# EAGLE design microvboatBOARD (EAGLE 7.6.0)
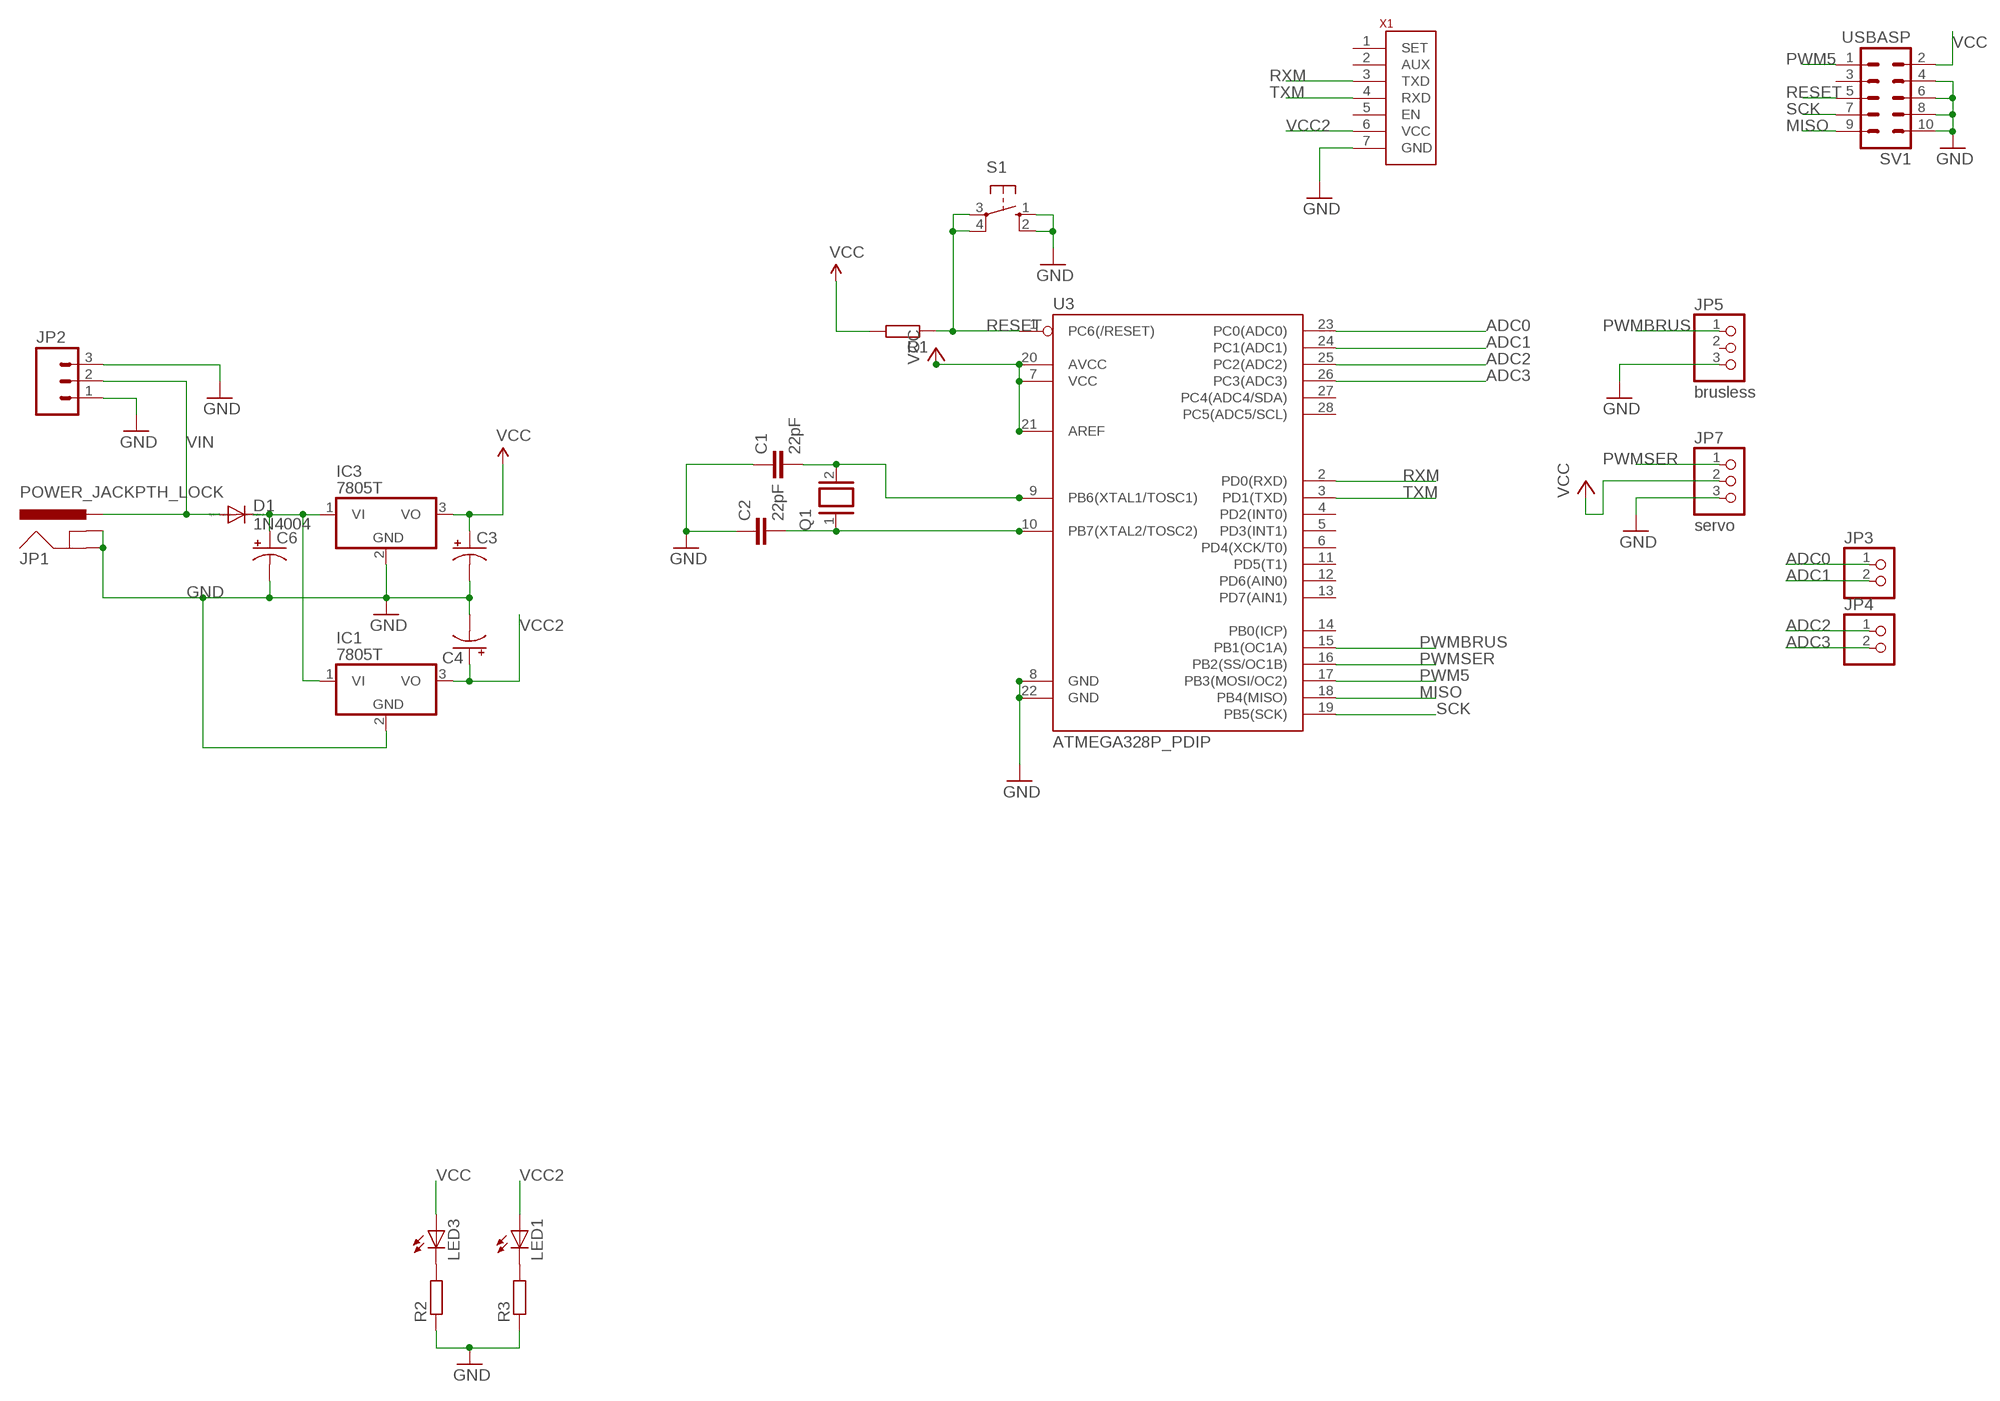
[diagram p0: schematic, sheet 1]

## Parts
C1  22pF  C2,5-3  [C2.5-3]
C2  22pF  C2,5-3  [C2.5-3]
C3  CPOL-USE2.5-5  [E2,5-5]
C4  CPOL-USE2.5-5  [E2,5-5]
C6  CPOL-USE2.5-5  [E2,5-5]
D1  1N4004  [DO41-10]
IC1  7805T  [TO220H]
IC3  7805T  [TO220H]
JP1  POWER_JACKPTH_LOCK  [POWER_JACK_PTH_LOCK]
JP2  M03POLAR  [MOLEX-1X3]
JP3  PINHD-1X2  [1X02]
JP4  PINHD-1X2  [1X02]
JP5  brusless  PINHD-1X3  [1X03]
JP7  servo  PINHD-1X3  [1X03]
LED1  LED3MM  [LED3MM]
LED3  LED3MM  [LED3MM]
Q1  XTAL/S  [QS]
R1  R-EU_0204/7  [0204/7]
R2  R-EU_0204/7  [0204/7]
R3  R-EU_0204/7  [0204/7]
S1  10-XX  [B3F-10XX]
SV1  USBASP  ML10  [ML10]
U3  ATMEGA328P_PDIP  [DIL28-3]
X1  APC220  [APC220]

## Nets
ADC0: JP3.1 U3.23(PC0(ADC0))
ADC1: JP3.2 U3.24(PC1(ADC1))
ADC2: JP4.1 U3.25(PC2(ADC2))
ADC3: JP4.2 U3.26(PC3(ADC3))
GND: C1.1 C2.1 C3.- C4.- C6.- IC1.2(GND) IC3.2(GND) JP1.GND JP1.GNDBREAK JP2.1 JP2.3 JP5.3 JP7.3 R2.1 R3.1 S1.1(S) S1.2(S1) SV1.4 SV1.6 SV1.8 SV1.10 U3.8(GND) U3.22(GND) X1.7(GND)
MISO: SV1.9 U3.18(PB4(MISO))
N$1: LED3.K(C) R2.2
N$2: C1.2 Q1.2 U3.9(PB6(XTAL1/TOSC1))
N$3: C2.2 Q1.1 U3.10(PB7(XTAL2/TOSC2))
N$4: LED1.K(C) R3.2
N$6: C6.+ D1.C IC1.1(VI) IC3.1(VI)
PWM5: SV1.1 U3.17(PB3(MOSI/OC2))
PWMBRUS: JP5.1 U3.15(PB1(OC1A))
PWMSER: JP7.1 U3.16(PB2(SS/OC1B))
RESET: R1.1 S1.3(P) S1.4(P1) SV1.5 U3.1(PC6(/RESET))
RXM: U3.2(PD0(RXD)) X1.3(TXD)
SCK: SV1.7 U3.19(PB5(SCK))
TXM: U3.3(PD1(TXD)) X1.4(RXD)
VCC: C3.+ IC3.3(VO) JP7.2 LED3.A R1.2 SV1.2 U3.7(VCC) U3.20(AVCC) U3.21(AREF)
VCC2: C4.+ IC1.3(VO) LED1.A X1.6(VCC)
VIN: D1.A JP1.PWR JP2.2
Unconnected: JP5.2 SV1.3 U3.4(PD2(INT0)) U3.5(PD3(INT1)) U3.6(PD4(XCK/T0)) U3.11(PD5(T1)) U3.12(PD6(AIN0)) U3.13(PD7(AIN1)) U3.14(PB0(ICP)) U3.27(PC4(ADC4/SDA)) U3.28(PC5(ADC5/SCL)) X1.1(SET) X1.2(AUX) X1.5(EN)

## Library data of the parts
C1 C2 = capacitor-wima:C: CAPACITOR naming: grid - package width
C3 C4 C6 = rcl:CPOL-US: POLARIZED CAPACITOR, American symbol
D1 = diode:1N4004: DIODE general purpose rectifier, 1 A
IC1 IC3 = linear:78*: Positive VOLTAGE REGULATOR Source: http://cache.national.com/ds/LM/LM78L05.pdf http://www.fairchildsemi.com/ds/LM/LM7805.pdf
JP1 = SparkFun-Connectors:POWER_JACK: Power Jack This is the standard 5.5mm barrel jack for power. The PTH is the most common, proven, reliable, footprint. The Slot footprint only works if the mill layer is transmitted to the PCB fab house so be warned. Mating wall wart : TOL-00298 (and others); PROD_ID: CONN-08197; SF_ID: PRT-00119
JP2 = SparkFun-Connectors:M03: Header 3 Standard 3-pin 0.1" header. Use with straight break away headers (SKU : PRT-00116), right angle break away headers (PRT-00553), swiss pins (PRT-00743), machine pins (PRT-00117), and female headers (PRT-00115). Molex polarized connector foot print use with SKU : PRT-08232 with associated crimp pins and housings.
JP3 JP4 = pinhead:PINHD-1X2: PIN HEADER
JP5 JP7 = pinhead:PINHD-1X3: PIN HEADER
LED1 LED3 = led:LED: LED OSRAM: - CHIPLED LG R971, LG N971, LY N971, LG Q971, LY Q971, LO R971, LY R971 LH N974, LH R974 LS Q976, LO Q976, LY Q976 LO Q996 - Hyper CHIPLED LW Q18S LB Q993, LB Q99A, LB R99A - SideLED LS A670, LO A670, LY A670, LG A670, LP A670 LB A673, LV A673, LT A673, LW A673 LH A674 LY A675 LS A676, LA A676, LO A676, LY A676, LW A676 LS A679, LY A679, LG A679 - Hyper Micro SIDELED® LS Y876, LA Y876, LO Y876, LY Y876 LT Y87S - SmartLED LW L88C, LW L88S LB L89C, LB L89S, LG L890 LS L89K, LO L89K, LY L89K LS L896, LA L896, LO L896, LY L896 - TOPLED LS T670, LO T670, LY T670, LG T670, LP T670 LSG T670, LSP T670, LSY T670, LOP T670, LYG T670 LG T671, LOG T671, LSG T671 LB T673, LV T673, LT T673, LW T673 LH T674 LS T676, LA T676, LO T676, LY T676, LB T676, LH T676, LSB T676, LW T676 LB T67C, LV T67C, LT T67C, LS T67K, LO T67K, LY T67K, LW E67C LS E67B, LA E67B, LO E67B, LY E67B, LB E67C, LV E67C, LT E67C LW T67C LS T679, LY T679, LG T679 LS T770, LO T770, LY T770, LG T770, LP T770 LB T773, LV T773, LT T773, LW T773 LH T774 LS E675, LA E675, LY E675, LS T675 LS T776, LA T776, LO T776, LY T776, LB T776 LHGB T686 LT T68C, LB T68C - Hyper Mini TOPLED® LB M676 - Mini TOPLED Santana® LG M470 LS M47K, LO M47K, LY M47K Source: http://www.osram.convergy.de LUXEON: - LUMILED® LXK2-PW12-R00, LXK2-PW12-S00, LXK2-PW14-U00, LXK2-PW14-V00 LXK2-PM12-R00, LXK2-PM12-S00, LXK2-PM14-U00 LXK2-PE12-Q00, LXK2-PE12-R00, LXK2-PE12-S00, LXK2-PE14-T00, LXK2-PE14-U00 LXK2-PB12-K00, LXK2-PB12-L00, LXK2-PB12-M00, LXK2-PB14-N00, LXK2-PB14-P00, LXK2-PB14-Q00 LXK2-PR12-L00, LXK2-PR12-M00, LXK2-PR14-Q00, LXK2-PR14-R00 LXK2-PD12-Q00, LXK2-PD12-R00, LXK2-PD12-S00 LXK2-PH12-R00, LXK2-PH12-S00 LXK2-PL12-P00, LXK2-PL12-Q00, LXK2-PL12-R00 Source: www.luxeon.com KINGBRIGHT: KA-3528ASYC Source: www.kingbright.com
Q1 = special:XTAL/S: CRYSTAL
R1-R3 = rcl:R-EU_: RESISTOR, European symbol
S1 = switch-omron:10-XX: OMRON SWITCH; MPN: B3F-1000; OC_FARNELL: 176432; OC_NEWARK: 36M3542
SV1 = con-ml:ML10: HARTING; OC_FARNELL: unknown; OC_NEWARK: unknown
U3 = SparkFun-DigitalIC:ATMEGA328P_PDIP: uC used in the Arduino 32kb flash, 1k EEPROM, 2k SRAM This is the through-hole version of this chip.
X1 = APC220:APC220; APC220: APC220

## Board
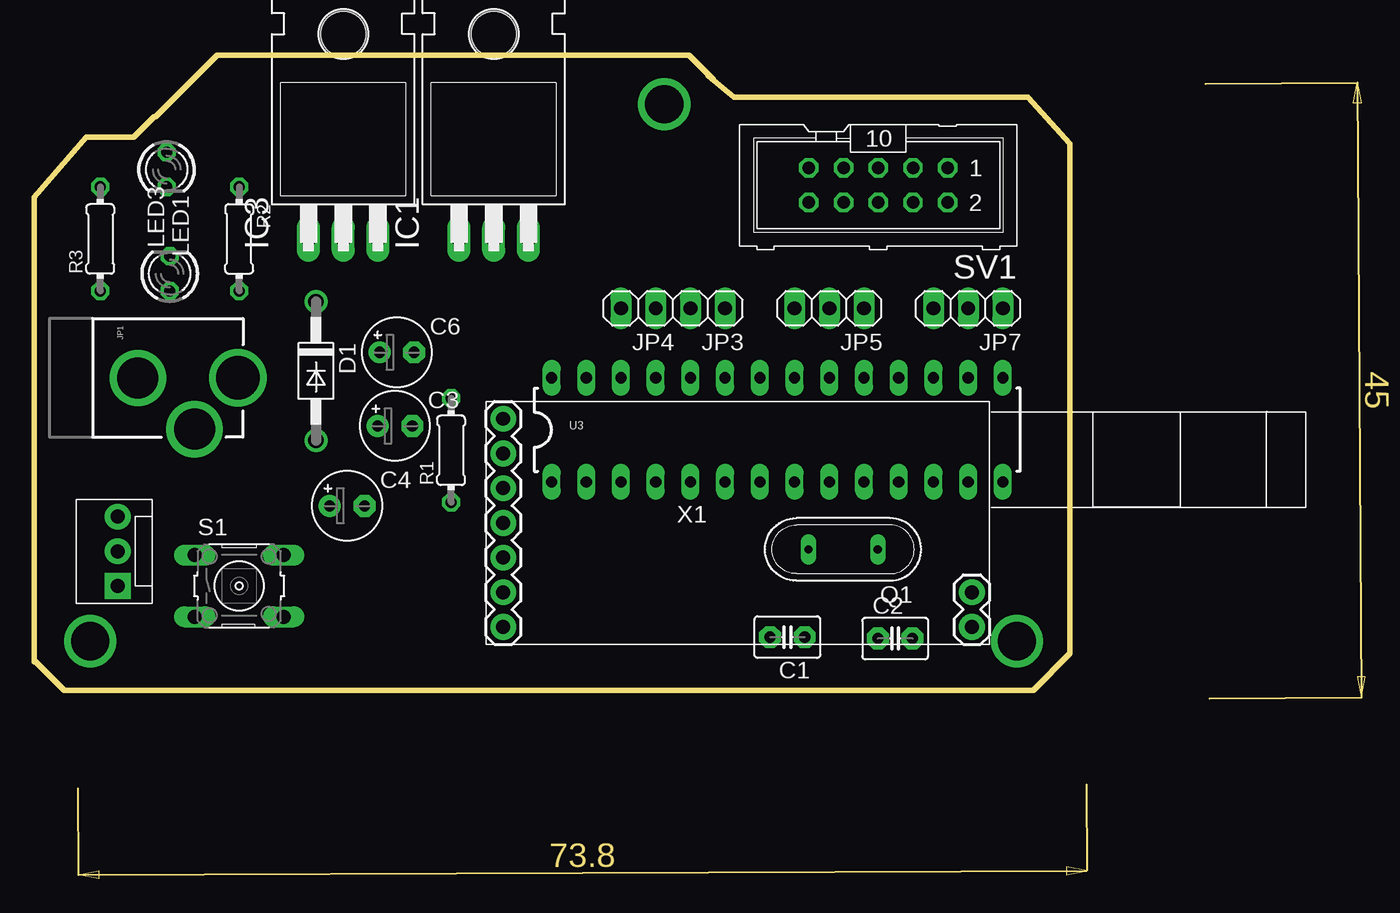
[diagram p1: board, top side]
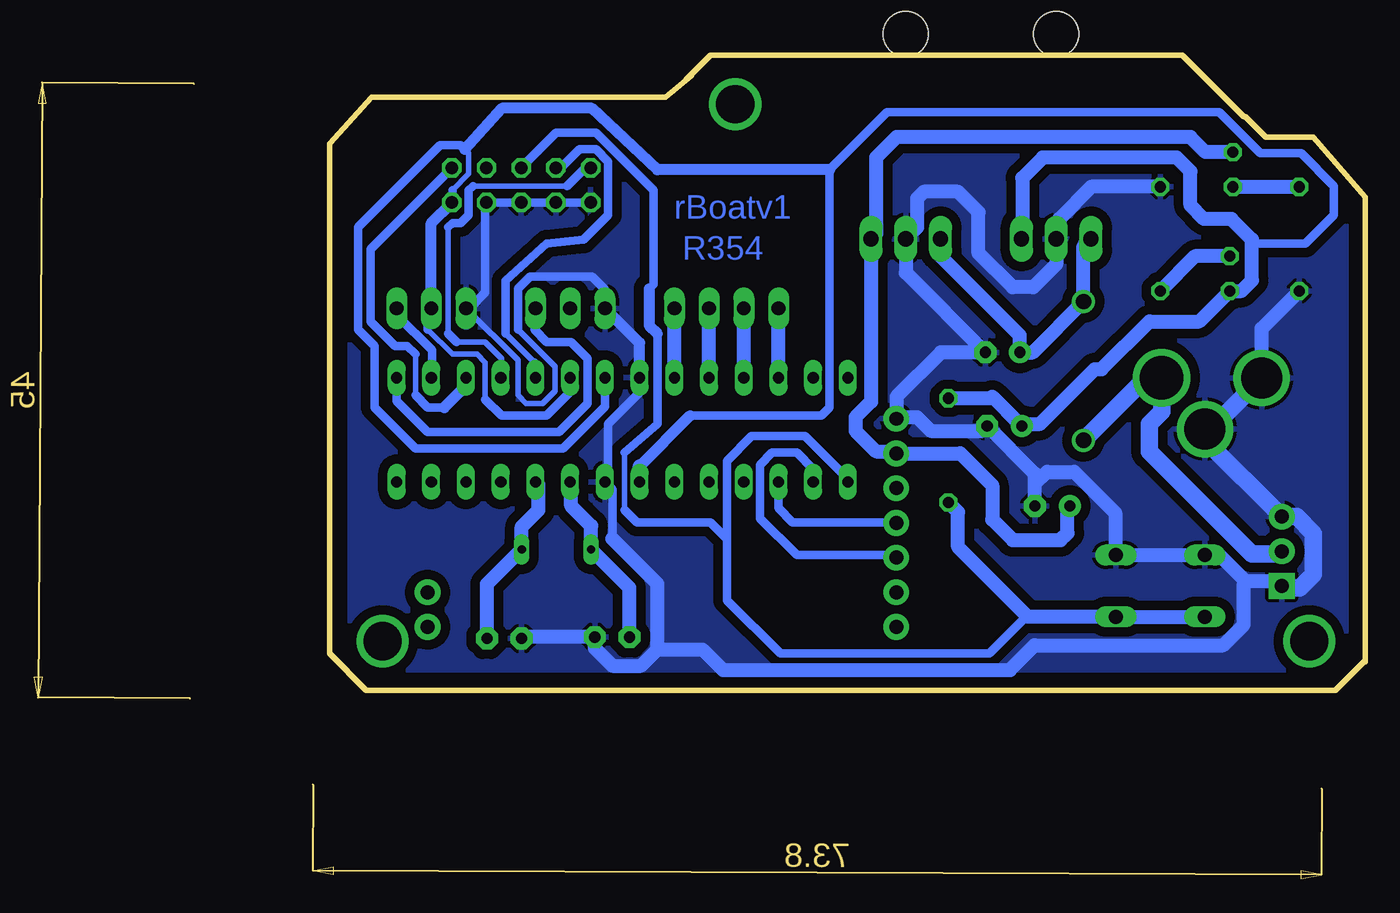
[diagram p2: board, bottom side, seen from below]

Size 75.8 x 46.5 mm. Coordinates in mm from the lower left corner, seen from the top.
Outline: 49.3,45 51.2,43.4 72.7,43.4 75.8,40 75.8,4
Outline: 73,0 2.2,0 0,2.2
Outline: 0,2.1 0,2.2
Outline: 0,2.2 0,36.1 3.8,40.5 7.3,40.5 8.8,42
Outline: 8.9,42 13.4,46.5 47.9,46.5 49.7,44.7
Outline: 75.8,3.9 75.8,2.7 73.1,0
Copper layers (1*16): Top 0.035mm / dielectric 1.5mm / Bottom 0.035mm
Design rules "default": minimum track width 10mil, minimum drill 24mil, track to track 8mil, track to pad 8mil, pad to pad 8mil, via to via 8mil, smd to smd 8mil, copper to edge 40mil, drill to drill 8mil, minimum pad ring 10mil, minimum via ring 8mil, stop-mask expansion 4mil, vias tented up to drill 0mil, thermal gap 10mil

### Footprints (pad centres in the part's own frame; a part is rotated, then mirrored left to right if it is on the bottom)
C2.5-3 = drill 0.813 pad 1.6 octagon: 1 -1.27,0; 2 1.27,0
E2,5-5 = drill 0.813 pad 1.6: + -1.27,0 | drill 0.813 pad 1.6 octagon: - 1.27,0
DO41-10 = drill 1.118: A 5.08,0; C -5.08,0
TO220H = drill 1.118 long: 1 -2.54,-10.16; 2 0,-10.16; 3 2.54,-10.16 | hole 3.302: 0,4.826
POWER_JACK_PTH_LOCK = drill 2.997 pad 4.115: GND 0.025,6.557; GNDBREAK 3.762,10.7 | drill 3.2 pad 4.115: PWR 0,13.878
MOLEX-1X3 = drill 1.016 pad 1.88 square: 1 0,0 | drill 1.016 pad 1.88: 2 2.54,0; 3 5.08,0
1X02 = drill 1.016 long: 1 -1.27,0; 2 1.27,0
1X03 = drill 1.016 long: 1 -2.54,0; 2 0,0; 3 2.54,0
LED3MM = drill 0.813 octagon: A -1.27,0; K 1.27,0
QS = drill 0.61 long: 1 -2.54,0; 2 2.54,0
0204/7 = drill 0.813 octagon: 1 -3.81,0; 2 3.81,0
B3F-10XX = drill 1.016 long: 1 -3.251,2.261; 2 3.251,2.261; 3 -3.251,-2.261; 4 3.251,-2.261
ML10 = drill 0.914 octagon: 1 -5.08,-1.27; 2 -5.08,1.27; 3 -2.54,-1.27; 4 -2.54,1.27; 5 0,-1.27; 6 0,1.27; 7 2.54,-1.27; 8 2.54,1.27; 9 5.08,-1.27; 10 5.08,1.27
DIL28-3 = drill 0.813 long: 1 -16.51,-3.81; 2 -13.97,-3.81; 3 -11.43,-3.81; 4 -8.89,-3.81; 5 -6.35,-3.81; 6 -3.81,-3.81; 7 -1.27,-3.81; 8 1.27,-3.81; 9 3.81,-3.81; 10 6.35,-3.81; 11 8.89,-3.81; 12 11.43,-3.81; 13 13.97,-3.81; 14 16.51,-3.81; 15 16.51,3.81; 16 13.97,3.81; 17 11.43,3.81; 18 8.89,3.81; 19 6.35,3.81; 20 3.81,3.81; 21 1.27,3.81; 22 -1.27,3.81; 23 -3.81,3.81; 24 -6.35,3.81; 25 -8.89,3.81; 26 -11.43,3.81; 27 -13.97,3.81; 28 -16.51,3.81
APC220 = drill 1.016 pad 1.88: 00 35.56,1.27; 1 1.27,1.27; 01 35.56,3.81; 2 1.27,3.81; 3 1.27,6.35; 4 1.27,8.89; 5 1.27,11.43; 6 1.27,13.97; 7 1.27,16.51

### Placement (x,y rotation side)
C1  55.11,3.9 180 top
C2  63,3.8 0 top
C3  26.4,19.35 0 top
C4  22.9,13.51 0 top
C6  26.54,24.74 0 top
D1  20.62,23.38 270 top
IC1  33.63,43.2 0 top
IC3  22.62,43.2 0 top
JP1  1.03,22.88 270 top
JP2  6.11,7.64 90 top
JP3  49.29,27.96 180 top
JP4  44.21,27.96 180 top
JP5  58.18,27.96 180 top
JP7  68.34,27.96 180 top
LED1  9.69,38.12 270 top
LED3  9.92,30.5 90 top
Q1  59.19,10.32 180 top
R1  30.51,17.57 90 top
R2  15,33.04 270 top
R3  4.84,33.04 90 top
S1  15,7.64 0 top
SV1  61.76,36.97 180 top
U3  54.37,19.07 0 top
X1  33.05,3.37 0 top

### Tracks (layer width: path | path; a pad name or v marks a point on that pad's centre or on a via)
ADC0
  Bottom 1.016: U3.23 JP3.1
ADC1
  Bottom 1.016: U3.24 JP3.2
ADC2
  Bottom 1.016: U3.25 JP4.1
ADC3
  Bottom 1.016: U3.26 JP4.2
GND
  Bottom 0.406: 55.1,11.1 55.1,10.8 52.1,7.8 52.1,3.6 51.5,3 | 62,26.4 59.3,23.7 59.3,21.9 60.2,21 61.4,21 62,21.6 62,24.16 JP7.3
  Bottom 0.61: JP7.3 65.54,27.96 64.4,29.1 64.4,35.6 SV1.4 SV1.6 SV1.8 SV1.10 | U3.22 53.1,21.8 55.4,19.5 55.4,15.5 U3.8 55.1,14.72 55.1,11.1 | JP5.3 55.64,29.34 56.6,30.3 61.1,30.3 62,29.4 62,26.4
  Bottom 0.813: U3.22 53.1,25.42 JP5.3
  Bottom 1.016: JP1.GND 7.59,26.48 R3.1 | R2.1 20.05,36.85 22.4,34.5 22.4,33.26 IC3.2 22.62,31.18 24.3,29.5 25.8,29.5 28.3,32 28.3,35 29.8,36.5 32.3,36.5 32.8,36 32.8,33.87 IC1.2 33.63,30.56 C6.- 31.06,24.74 34.3,21.5 34.3,20 | 34.3,20 34.3,19.9 X1.7 | 34.3,20 32.8,20 31.8,19 28.02,19 C3.- 24.17,15.85 C4.- 24.17,15.13 23.3,16 21.3,16 18.3,13 18.3,9.95 S1.2 S1.1 10.7,9.9 8.8,8 8.6,8 | 8.6,8 6.47,8 JP2.1 | C2.1 61.63,3.9 C1.1 56.38,3.08 55.1,1.8 53,1.8 51.8,3 51.8,7.8 55.1,11.1 | 51.5,3 48.5,3 47,1.5 26,1.5 24.2,3.3 10.4,3.3 8.9,4.8 8.9,7.7 8.6,8
  Bottom 1.27: JP1.GND 11.32,19.12 JP1.GNDBREAK 11.73,18.34 JP2.3 5.02,12.72 3.8,11.5 3.8,8.5 4.8,7.5 5.97,7.5 JP2.1
  pour Bottom (isolate 0.7): 1.1,35.4 1.1,3 2.6,1.5 71.9,1.5 74.3,3.9 74.3,39.3 74,39.6 71.6,42 50.3,42 47,45.3 13.7,45.3 11,42.6 7.4,39 4.7,39
MISO
  Bottom 0.406: 67.1,33.9 67.1,26.1 | 66.5,25.5 64.4,25.5 63.2,24.3 63.2,22.94 | 58.4,36.9 65.3,36.9
  Bottom 0.61: 67.1,26.1 66.5,25.5 | 63.2,22.94 U3.18 | 67.1,33.9 66.8,34.2 66.2,34.2 65.6,34.8 65.6,36.6 65.3,36.9 | SV1.9 57.06,38.24 58.4,36.9
N$1
  Bottom 1.016: LED3.K 12.46,31.77 R2.2
N$2
  Bottom 1.016: U3.9 58.1,15.18 58.1,13.5 56.65,12.05 Q1.2 53.84,7.51 C1.2
N$3
  Bottom 1.016: U3.10 60.5,15.04 60.5,13.2 61.73,11.97 Q1.1 64.27,7.78 C2.2
N$4
  Bottom 1.016: LED1.K R3.2
N$5  (via drill 2.8 pad 1.27)
  other vias: 46.1,42.9
N$6
  Bottom 1.016: IC3.1 20.62,32.5 D1.C 24.34,24.74 C6.+ 25.3,24.77 25.3,26 31.09,31.79 IC1.1
N$7  (via drill 2.8 pad 1.27)
  other vias: 71.9,3.6
N$8  (via drill 2.8 pad 1.27)
  other vias: 4.1,3.6
PWM5
  Bottom 0.406: 69.5,21.6 69.5,24.6
  Bottom 0.61: 69.5,21.6 68.6,20.7 67.4,20.7 | SV1.1 72.8,32.28 72.8,27 71,25.2 70.1,25.2 69.5,24.6
  Bottom 0.813: U3.17 65.8,22.3 67.4,20.7
PWMBRUS
  Bottom 0.61: U3.15 70.88,21.18 68.6,18.9 59,18.9 56.9,21 56.9,24.3 58.1,25.5 59.9,25.5 60.8,26.4 60.8,27.88 JP5.1
PWMSER
  Bottom 0.61: JP7.1 70.88,27.48 68.3,24.9 68.3,22.92 U3.16
RESET
  Bottom 0.406: 54.2,17.4 54.2,13.2
  Bottom 0.61: U3.1 37.86,15.46 41,18.6 44.9,18.6 46.7,16.8 46.7,11.1 | 46.7,11.1 46.7,6.6 42.8,2.7 27.5,2.7 24.75,5.45 | 51.8,26.1 51.8,19.5 54.2,17.4 | 54.2,13.2 53.3,12.3 47.9,12.3 46.7,11.1 | 52.4,29.4 52.1,29.7 52.1,36.6 56.3,40.8 59.2,40.8 SV1.5
  Bottom 0.813: 52.4,29.4 52.4,26.7 51.8,26.1
  Bottom 1.016: R1.1 29.8,13.05 29.8,10.5 24.75,5.45 24.68,5.38 S1.4 S1.3
RXM
  Bottom 0.61: U3.2 40.4,16.2 41.6,17.4 43.4,17.4 44.3,16.5 44.3,12.6 41.6,9.9 34.5,9.9 X1.3
SCK
  Bottom 0.406: 60.8,24 62.9,26.1
  Bottom 0.61: SV1.7 58.86,38.24 57.5,39.6 56.3,39.6 55.4,38.7 55.4,34.8 57.2,33 59.9,32.7 62.9,30 62.9,26.1 | U3.19 60.8,22.96 60.8,24
TXM
  Bottom 0.61: U3.3 42.94,13.34 41.9,12.3 34.36,12.3 X1.4
VCC
  Bottom 0.406: 64.4,21.3 64.4,24 65,24.6 66.8,24.6 68.6,26.4 | 65.9,39.6 65.6,39.3 65.6,37.8 66.8,36.6
  Bottom 0.61: U3.20 58.18,21.82 59.9,20.1 63.2,20.1 64.4,21.3 | 68.6,26.4 68.6,27.7 JP7.2 | U3.21 55.64,20.76 58.7,17.7 69.5,17.7 72.5,20.7 72.5,25.2 73.7,26.4 73.7,33.9 67.7,39.9 66.2,39.9 65.9,39.6 | 66.8,36.6 66.8,35.74 SV1.2 | 49.4,20.1 39.8,20.1 39.2,20.7 39.2,38.1 35,42.3 10.7,42.3 7.7,39.3 4.7,39.3 2.3,36.9 2.3,34.8 4.4,32.7 8.3,32.7
  Bottom 0.813: JP7.2 68.34,34.2 SV1.2 | 53.1,16.4 49.4,20.1 | 39.2,38.1 51.8,38.1 56.6,42.6 63.2,42.6 65.9,39.6
  Bottom 1.016: C3.+ 27.16,21.38 R1.2 27.42,21.38 27.3,21.5 25.3,19.5 23.8,19.5 19.8,23.5 19.3,23.5 15.8,27 12.15,27 LED3.A 9.07,29.23 8.3,30 8.3,32.7 8.3,33 9.8,34.5 11.8,34.5 12.8,35.5 12.8,38 13.8,39 23.6,39 25.1,37.5 25.1,33.1 IC3.3 | U3.7 53.1,16.4
VCC2
  Bottom 1.016: LED1.A 11.69,39.39 12.8,40.5 34.3,40.5 35.8,39 35.8,33.41 IC1.3 36.17,21.13 37.3,20 37.3,19 35.8,17.5 34.48,17.5 X1.6 29.64,17.34 27.3,15 27.3,12.5 25.8,11 22.3,11 21.8,11.5 21.8,13.34 C4.+
VIN
  Bottom 1.27: D1.A 16.04,22.88 JP1.PWR 14.91,20.39 15.8,19.5 15.8,17.5 8.3,10 6.29,10 JP2.2

### Text on the board
Bottom: rBoatv1 | R354